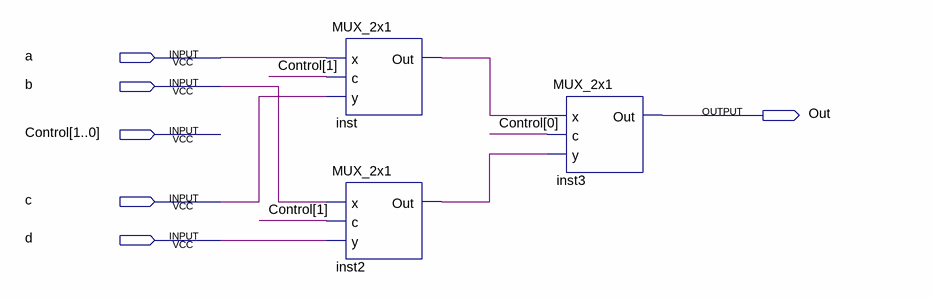
[diagram p0: schematic sheet]
// Quartus schematic MUX_4x1.bdf as structural Verilog: 3 symbols, 6 pins
module MUX_4x1 (
  input  a,
  input  b,
  input  [1:0] Control,
  input  c,
  input  d,
  output Out
);

  wire inst2_out, inst_out;

  MUX_2x1 inst (.x(a), .c(Control[1]), .y(c), .Out(inst_out));
  MUX_2x1 inst2 (.x(b), .c(Control[1]), .y(d), .Out(inst2_out));
  MUX_2x1 inst3 (.x(inst_out), .c(Control[0]), .y(inst2_out), .Out(Out));
endmodule
